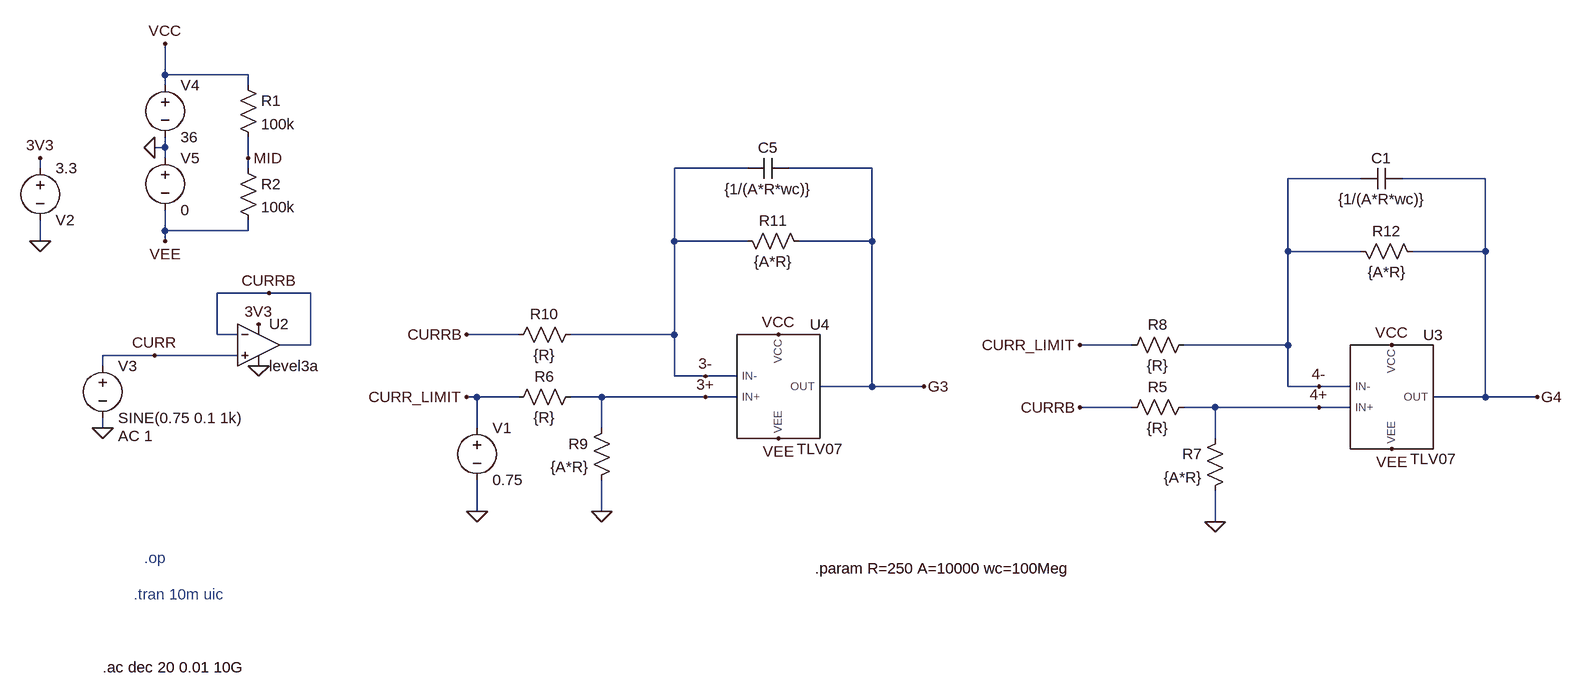
[diagram p0: schematic diff_amp+lpf.asc]
diff_amp+lpf.asc, the LTspice schematic file:
Version 4
SHEET 1 3184 680
WIRE -832 -288 -832 -336
WIRE -704 -288 -832 -288
WIRE -832 -272 -832 -288
WIRE -704 -272 -704 -288
WIRE -832 -176 -832 -192
WIRE -832 -176 -848 -176
WIRE -832 -160 -832 -176
WIRE -704 -160 -704 -192
WIRE -1024 -144 -1024 -160
WIRE -704 -144 -704 -160
WIRE 64 -144 -48 -144
WIRE 256 -144 128 -144
WIRE 1008 -128 896 -128
WIRE 1200 -128 1072 -128
WIRE -832 -48 -832 -80
WIRE -704 -48 -704 -64
WIRE -704 -48 -832 -48
WIRE -1024 -32 -1024 -64
WIRE -832 -32 -832 -48
WIRE -48 -32 -48 -144
WIRE 64 -32 -48 -32
WIRE 256 -32 256 -144
WIRE 256 -32 144 -32
WIRE 896 -16 896 -128
WIRE 1008 -16 896 -16
WIRE 1200 -16 1200 -128
WIRE 1200 -16 1088 -16
WIRE -672 48 -752 48
WIRE -608 48 -672 48
WIRE -752 112 -752 48
WIRE -720 112 -752 112
WIRE -288 112 -368 112
WIRE -48 112 -48 -32
WIRE -48 112 -208 112
WIRE -608 128 -608 48
WIRE -608 128 -656 128
WIRE 656 128 576 128
WIRE 896 128 896 -16
WIRE 896 128 736 128
WIRE -848 144 -928 144
WIRE -720 144 -848 144
WIRE -928 160 -928 144
WIRE -48 176 -48 112
WIRE 0 176 -48 176
WIRE 48 176 0 176
WIRE 256 192 256 -32
WIRE 256 192 176 192
WIRE 336 192 256 192
WIRE 896 192 896 128
WIRE 944 192 896 192
WIRE 992 192 944 192
WIRE -352 208 -368 208
WIRE -288 208 -352 208
WIRE -160 208 -208 208
WIRE 0 208 -160 208
WIRE 48 208 0 208
WIRE 1200 208 1200 -16
WIRE 1200 208 1120 208
WIRE 1280 208 1200 208
WIRE 656 224 576 224
WIRE 784 224 736 224
WIRE 944 224 784 224
WIRE 992 224 944 224
WIRE -928 256 -928 240
WIRE -352 256 -352 208
WIRE -160 256 -160 208
WIRE 784 272 784 224
WIRE -352 384 -352 336
WIRE -160 384 -160 336
WIRE 784 400 784 352
FLAG -1024 -32 0
FLAG -848 144 CURR
FLAG -928 256 0
FLAG -832 -32 VEE
FLAG -832 -336 VCC
FLAG -848 -176 0
FLAG -160 384 0
FLAG 112 112 VCC
FLAG 112 272 VEE
FLAG 336 192 G3
FLAG -368 112 CURRB
FLAG -368 208 CURR_LIMIT
FLAG 0 208 3+
FLAG 0 176 3-
FLAG -704 -160 MID
FLAG -352 384 0
FLAG -1024 -160 3V3
FLAG -688 96 3V3
FLAG -688 160 0
FLAG -672 48 CURRB
FLAG 784 400 0
FLAG 1056 128 VCC
FLAG 1056 288 VEE
FLAG 1280 208 G4
FLAG 576 224 CURRB
FLAG 576 128 CURR_LIMIT
FLAG 944 224 4+
FLAG 944 192 4-
SYMBOL voltage -1024 -160 R0
WINDOW 0 24 96 Left 2
WINDOW 3 24 16 Left 2
WINDOW 123 0 0 Left 0
WINDOW 39 0 0 Left 0
SYMATTR InstName V2
SYMATTR Value 3.3
SYMBOL voltage -928 144 R0
WINDOW 123 24 124 Left 2
WINDOW 39 0 0 Left 0
SYMATTR Value2 AC 1
SYMATTR InstName V3
SYMATTR Value SINE(0.75 0.1 1k)
SYMBOL voltage -832 -288 R0
WINDOW 123 0 0 Left 0
WINDOW 39 0 0 Left 0
SYMATTR InstName V4
SYMATTR Value 36
SYMBOL voltage -832 -176 R0
WINDOW 123 0 0 Left 0
WINDOW 39 0 0 Left 0
SYMATTR InstName V5
SYMATTR Value 0
SYMBOL TLV07 112 192 R0
SYMATTR InstName U4
SYMBOL res -192 192 R90
WINDOW 0 0 56 VBottom 2
WINDOW 3 32 56 VTop 2
SYMATTR InstName R6
SYMATTR Value {R}
SYMBOL res -144 240 M0
SYMATTR InstName R9
SYMATTR Value {A*R}
SYMBOL res -192 96 R90
WINDOW 0 0 56 VBottom 2
WINDOW 3 32 56 VTop 2
SYMATTR InstName R10
SYMATTR Value {R}
SYMBOL res 160 -16 M270
WINDOW 0 32 56 VTop 2
WINDOW 3 0 56 VBottom 2
SYMATTR InstName R11
SYMATTR Value {A*R}
SYMBOL cap 128 -160 R90
WINDOW 0 0 32 VBottom 2
WINDOW 3 32 32 VTop 2
SYMATTR InstName C5
SYMATTR Value {1/(A*R*wc)}
SYMBOL res -720 -288 R0
SYMATTR InstName R1
SYMATTR Value 100k
SYMBOL res -720 -160 R0
SYMATTR InstName R2
SYMATTR Value 100k
SYMBOL voltage -352 240 R0
WINDOW 123 0 0 Left 0
WINDOW 39 0 0 Left 0
SYMATTR InstName V1
SYMATTR Value 0.75
SYMBOL OpAmps\\UniversalOpAmp3 -688 128 R0
SYMATTR InstName U2
SYMBOL TLV07 1056 208 R0
SYMATTR InstName U3
SYMBOL res 752 208 R90
WINDOW 0 0 56 VBottom 2
WINDOW 3 32 56 VTop 2
SYMATTR InstName R5
SYMATTR Value {R}
SYMBOL res 800 256 M0
SYMATTR InstName R7
SYMATTR Value {A*R}
SYMBOL res 752 112 R90
WINDOW 0 0 56 VBottom 2
WINDOW 3 32 56 VTop 2
SYMATTR InstName R8
SYMATTR Value {R}
SYMBOL res 1104 0 M270
WINDOW 0 32 56 VTop 2
WINDOW 3 0 56 VBottom 2
SYMATTR InstName R12
SYMATTR Value {A*R}
SYMBOL cap 1072 -144 R90
WINDOW 0 0 32 VBottom 2
WINDOW 3 32 32 VTop 2
SYMATTR InstName C1
SYMATTR Value {1/(A*R*wc)}
TEXT -864 456 Left 2 ;.op
TEXT 168 472 Left 2 !.param R=250 A=10000 wc=100Meg
TEXT -928 624 Left 2 !.ac dec 20 0.01 10G
TEXT -880 512 Left 2 ;.tran 10m uic

The netlist it stands for:
* diff_amp+lpf.asc
V2 3V3 0 3.3
V3 CURR 0 SINE(0.75 0.1 1k) AC 1
V4 VCC 0 36
V5 0 VEE 0
XU4 3+ 3- VCC VEE G3 TLV07  ; pins IN+ IN- VCC VEE OUT
R6 3+ CURR_LIMIT {R}
R9 3+ 0 {A*R}
R10 3- CURRB {R}
R11 G3 3- {A*R}
C5 G3 3- {1/(A*R*wc)}
R1 VCC MID 100k
R2 MID VEE 100k
V1 CURR_LIMIT 0 0.75
XU2 CURR CURRB 3V3 0 CURRB level3a  ; pins In+ In- V+ V- OUT
XU3 4+ 4- VCC VEE G4 TLV07  ; pins IN+ IN- VCC VEE OUT
R5 4+ CURRB {R}
R7 4+ 0 {A*R}
R8 4- CURR_LIMIT {R}
R12 G4 4- {A*R}
C1 G4 4- {1/(A*R*wc)}
* .op
.param R=250 A=10000 wc=100Meg
.ac dec 20 0.01 10G
* .tran 10m uic
.lib C:\Users\Tachi\Documents\Nerd Shit\rm_electrical-supercap\SPICE_sims\libraries\TLV07.LIB
.backanno
.end